# Altium project 2_Nets.PrjPcb
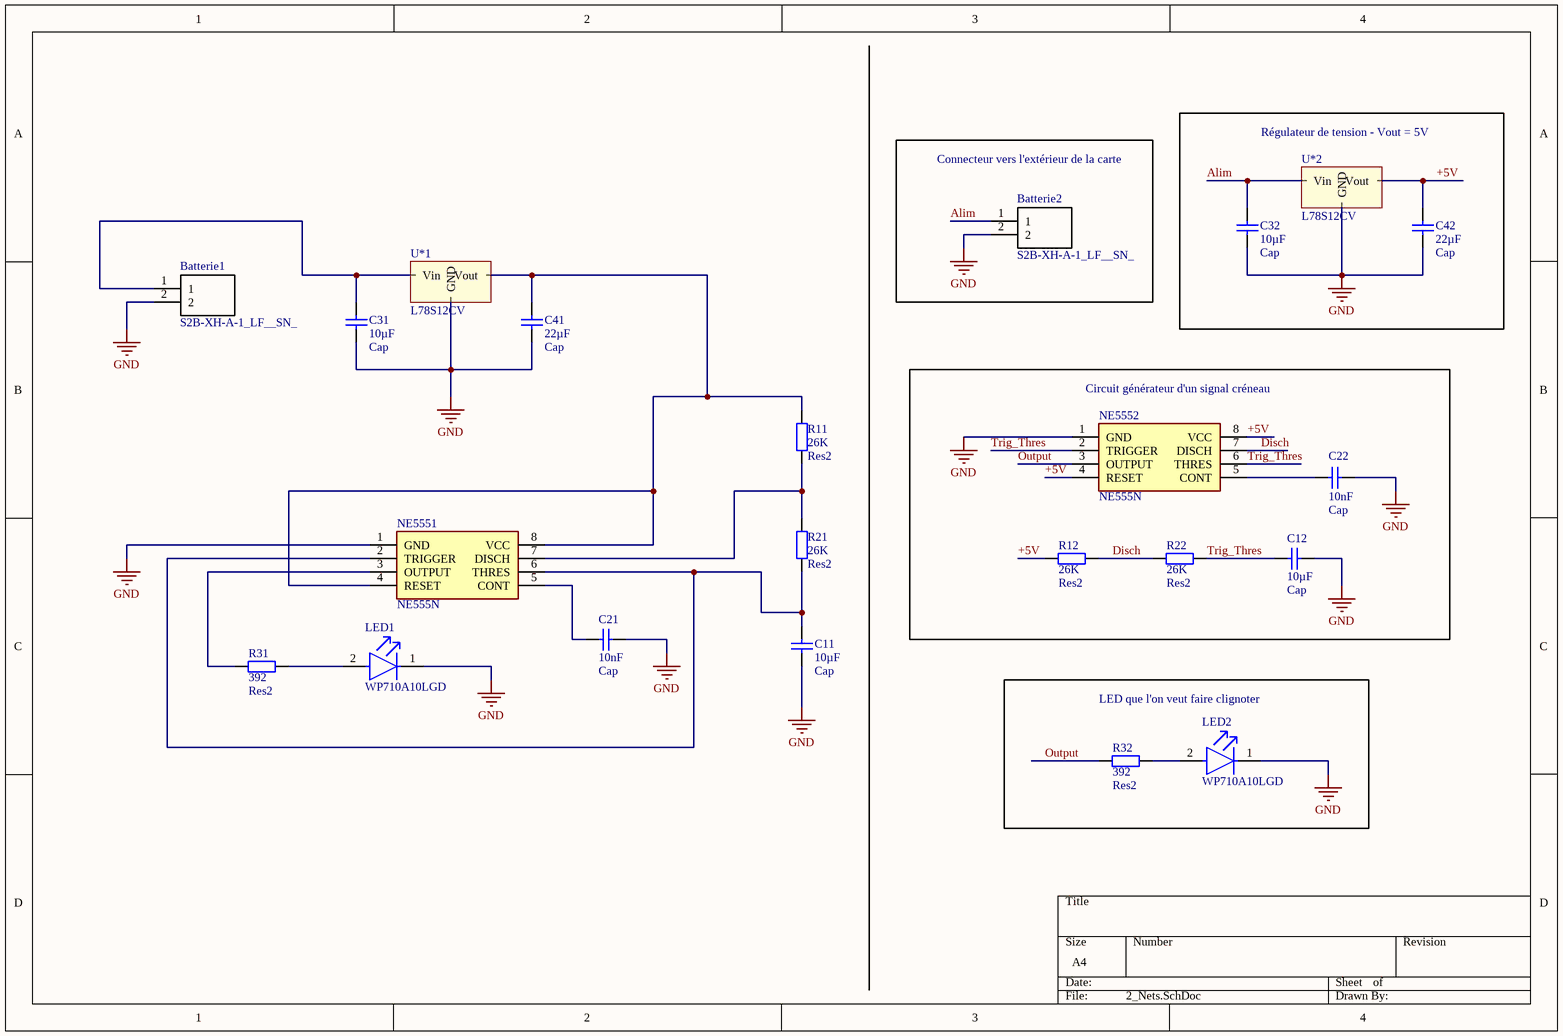
[diagram p0: 2_Nets.SchDoc]
1 sheet, 22 parts. Net scope: global (net labels, ports and power ports of the same name join across sheets).

## Sheet 2_Nets.SchDoc
size A4; SheetNumber: 1; SheetTotal: 1

### Parts
Batterie1  S2B-XH-A-1_LF__SN_  [S2B-XH-A]
Batterie2  S2B-XH-A-1_LF__SN_  [S2B-XH-A]
C11  Cap  value 10µF  [Capacitor 1206]
C12  Cap  value 10µF  [Capacitor 1206]
C21  Cap  value 10nF  [Capacitor 1206]
C22  Cap  value 10nF  [Capacitor 1206]
C31  Cap  value 10µF  [Capacitor 1206]
C32  Cap  value 10µF  [Capacitor 1206]
C41  Cap  value 22µF  [Capacitor 1206]
C42  Cap  value 22µF  [Capacitor 1206]
LED1  WP710A10LGD  [FP-WP710A10LGD-MFG]
LED2  WP710A10LGD  [FP-WP710A10LGD-MFG]
NE5551  NE555N  [DIP762W56P254L959H533Q8N]
NE5552  NE555N  [DIP762W56P254L959H533Q8N]
R11  Res2  value 26K  [Resistor 1206]
R12  Res2  value 26K  [Resistor 1206]
R21  Res2  value 26K  [Resistor 1206]
R22  Res2  value 26K  [Resistor 1206]
R31  Res2  value 392  [Resistor 1206]
R32  Res2  value 392  [Resistor 1206]
U*1  L78S12CV  [R-78B]
U*2  L78S12CV  [R-78B]

### Blocks framed on the sheet
Régulateur de tension - Vout = 5V: C32 C42 U*2
Connecteur vers l'extérieur de la carte: Batterie2
Circuit générateur d'un signal créneau: C12 C22 NE5552 R12 R22
LED que l'on veut faire clignoter: LED2 R32

### Nets
GND: Batterie1.2 Batterie2.2 C11.1 C12.1 C21.2 C22.2 C31.2 C32.2 C41.1 C42.1 LED1.1(C) LED2.1(C) NE5551.1(GND) NE5552.1(GND) U*1.2(GND) U*2.2(GND)
+5V: C42.2 NE5552.4(RESET) NE5552.8(VCC) R12.2 U*2.1(Vout)
Alim: Batterie2.1 C32.1 U*2.3(Vin)
Disch: NE5552.7(DISCH) R12.1 R22.2
Output: NE5552.3(OUTPUT) R32.2
Trig_Thres: C12.2 NE5552.2(TRIGGER) NE5552.6(THRES) R22.1
NetBatterie1_1: Batterie1.1 C31.1 U*1.3(Vin)
NetC11_2: C11.2 NE5551.2(TRIGGER) NE5551.6(THRES) R21.1
NetC21_1: C21.1 NE5551.5(CONT)
NetC22_1: C22.1 NE5552.5(CONT)
NetC41_2: C41.2 NE5551.4(RESET) NE5551.8(VCC) R11.2 U*1.1(Vout)
NetLED1_2: LED1.2(A) R31.1
NetLED2_2: LED2.2(A) R32.1
NetNE5551_3: NE5551.3(OUTPUT) R31.2
NetNE5551_7: NE5551.7(DISCH) R11.1 R21.2

### Library data of the parts
Batterie1 Batterie2 = S2B-XH-A-1_LF__SN_: Connector; Manufacturer_Name: JST (JAPAN SOLDERLESS TERMINALS); Manufacturer_Part_Number: S2B-XH-A-1(LF)(SN); Datasheet Link: http://www.jst-mfg.com/product/pdf/eng/eXH.pdf; Height: 6.1mm; Arrow Part Number: S2B-XH-A-1(LF)(SN)
C11 C12 C21 C22 C31 C32 C41 C42 = Cap: Capacitor; Published: 8-Jun-2000; LatestRevisionDate: 17-Jul-2002; LatestRevisionNote: Re-released for DXP Platform.; PackageReference: RAD-0.3; Publisher: Altium Limited; PackageDescription: Radial Cap, Thru-Hole; 2 Leads; 0.3 in Pin Spacing
LED1 LED2 = CMP-00682-20090258-1: WP710A10LGD LED Thru-Hole PCB Green T-1 3mm Green Lens 2 mA 568 nm 2 mcd Round; Number of LEDs: 1; Max Junction Temperature (Tj): 110°C; Viewing Angle: 40°; Reverse Voltage: 5V; Forward Voltage: 1.9V; Dominant Wavelength: 568nm; Luminous Intensity: 2mcd; Power Rating: 62.5mW; Forward Current: 2mA; Lens Style: Diffused, Dome, Round, Tinted; Height: 4.6mm; Mount: Through Hole; Illumination Color: Green; NexarPartId: 20090258; Number of Pins: 3; RoHS: Compliant; Max Operating Temperature: 85°C; Min Operating Temperature: -40°C; Lens Color: Green; Wavelength: 568nm; Color: Green; Schedule B: 8541402000, 8541402000; Case/Package: Radial; Power Dissipation: 62.5mW; Lead Free: Lead Free; Test Current: 2mA
NE5551 NE5552 = NE555N: Integrated Circuit; Manufacturer_Name: HGSEMI; Datasheet Link: https://datasheet.lcsc.com/szlcsc/1906111919_HGSEMI-NE555N_C398063.pdf; Height: 5.33mm; Manufacturer_Part_Number: NE555N
R11 R12 R21 R22 R31 R32 = Res2: Resistor; Published: 8-Jun-2000; LatestRevisionDate: 17-Jul-2002; LatestRevisionNote: Re-released for DXP Platform.; PackageReference: AXIAL-0.4; Publisher: Altium Limited; PackageDescription: Axial Device, Thru-Hole; 2 Leads; 0.4 in Pin Spacing
U*1 U*2 = Régulateur de tension linéaire: Vout: *; A: *